# EAGLE design RGBLEDModule (EAGLE 5.10)
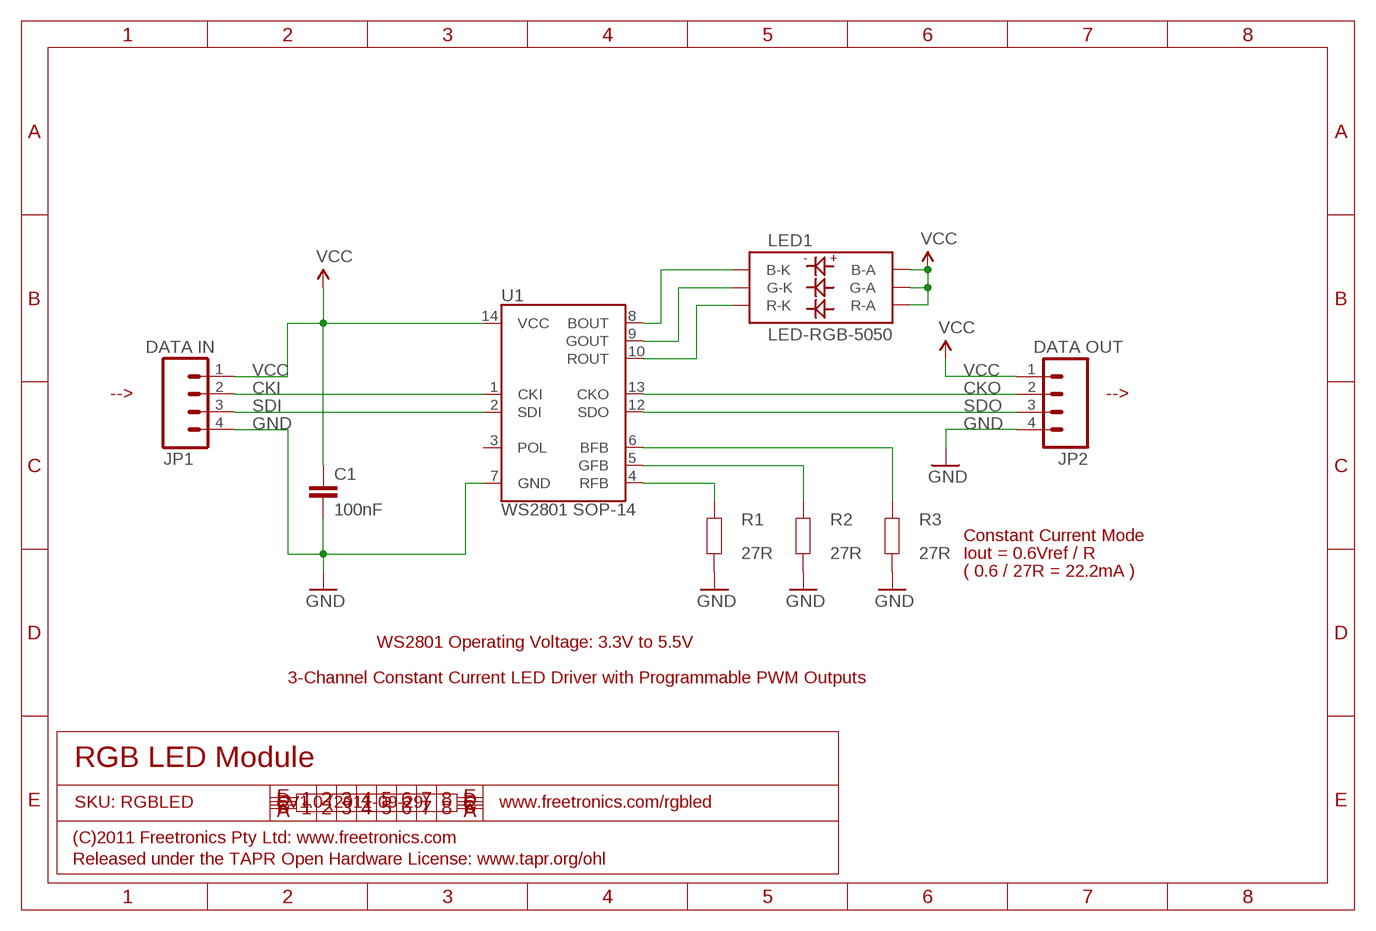
[diagram p0: schematic, sheet 1]

## Parts
C1  100nF  CAP0603  [0603]
JP1  DATA IN  M04PTH  [1X04]
JP2  DATA OUT  M04PTH  [1X04]
LED1  LED-RGB-5050  LED-RGB-50505050  [LED-RGB-5050]
R1  27R  RESISTOR0603  [0603]
R2  27R  RESISTOR0603  [0603]
R3  27R  RESISTOR0603  [0603]
U1  WS2801 SOP-14  WS2801  [SOP-14]

## Nets
CKI: JP1.2 U1.1(CKI)
CKO: JP2.2 U1.13(CKO)
GND: C1.2 JP1.4 JP2.4 R1.1 R2.1 R3.1 U1.7(GND)
N$7: LED1.BK(B-K) U1.8(BOUT)
N$8: LED1.GK(G-K) U1.9(GOUT)
N$9: LED1.RK(R-K) U1.10(ROUT)
N$13: R1.2 U1.4(RFB)
N$14: R2.2 U1.5(GFB)
N$15: R3.2 U1.6(BFB)
SDI: JP1.3 U1.2(SDI)
SDO: JP2.3 U1.12(SDO)
VCC: C1.1 JP1.1 JP2.1 LED1.BA(B-A) LED1.GA(G-A) LED1.RA(R-A) U1.14(VCC)
Unconnected: U1.3(POL)

## Notes on the sheet
- --> | -->
- Constant Current Mode
- Iout = 0.6Vref / R
- ( 0.6 / 27R = 22.2mA )
- WS2801 Operating Voltage: 3.3V to 5.5V
- 3-Channel Constant Current LED Driver with Programmable PWM Outputs
- RGB LED Module
- SKU: RGBLED | V1.0 (2011-09-29) | www.freetronics.com/rgbled
- (C)2011 Freetronics Pty Ltd: www.freetronics.com
- Released under the TAPR Open Hardware License: www.tapr.org/ohl

## Library data of the parts
C1 = freetronics-master-v1:CAP: Capacitor Standard 0603 ceramic capacitor, and 0.1" leaded capacitor.
JP1 JP2 = freetronics-master-v1:M04: Header 4 Standard 4-pin 0.1" header. Use with straight break away headers (SKU : PRT-00116), right angle break away headers (PRT-00553), swiss pins (PRT-00743), machine pins (PRT-00117), and female headers (PRT-00115). Molex polarized connector foot print use with SKU : PRT-08231 with associated crimp pins and housings.
LED1 = freetronics-master-v1:LED-RGB-5050
R1-R3 = freetronics-master-v1:RESISTOR: Resistor Basic schematic elements and footprints for 0603, 1206, and PTH 1/10th watt (small) resistors.
U1 = freetronics-master-v1:WS2801: WS2801 3 Channel Constant Current LED Driver with programmable PWM Outputs.

## Board
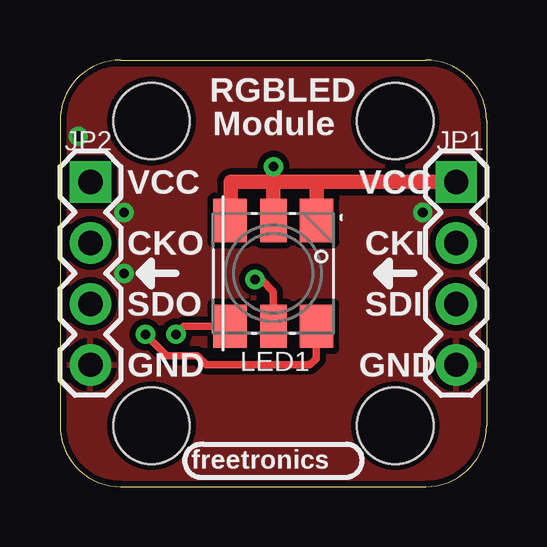
[diagram p1: board, top side]
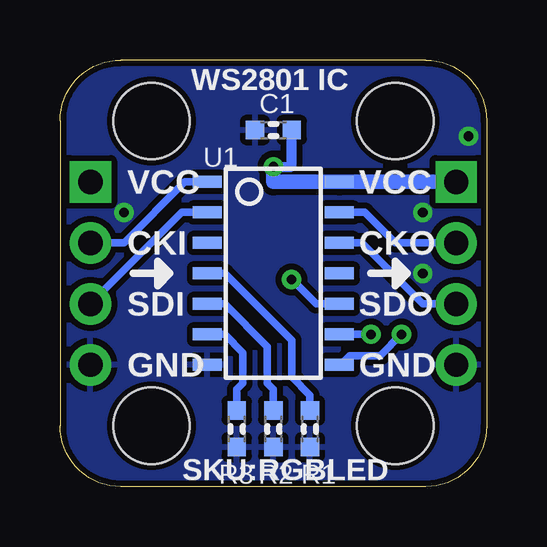
[diagram p2: board, bottom side, seen from below]

Size 17.78 x 17.78 mm. Coordinates in mm from the lower left corner, seen from the top.
Outline: 0,2.54 arc90 2.54,0 15.24,0 arc90 17.78,2.54 17.78,15.24 arc90 15.24,17.78 2.54,17.78 arc90 0,15.24 0,2.54
Copper layers (1*16): Top 0.035mm / dielectric 1.5mm / Bottom 0.035mm
Design rules "default *": minimum track width 8mil, minimum drill 15mil, track to track 10mil, track to pad 10mil, pad to pad 10mil, via to via 10mil, smd to smd 8mil, copper to edge 10mil, drill to drill 8mil, minimum pad ring 14mil, minimum via ring 8mil, stop-mask expansion 4mil, vias tented up to drill 25mil, thermal gap 10mil
Holes 3.17 mm at 3.81,2.54 13.97,2.54 3.81,15.24 13.97,15.24

### Footprints (pad centres in the part's own frame; a part is rotated, then mirrored left to right if it is on the bottom)
0603 = smd 0.762 x 0.762: 1 -0.762,0; 2 0.762,0
1X04 = drill 1.016 square: 1 0,0 | drill 1.016 round: 2 2.54,0; 3 5.08,0; 4 7.62,0
LED-RGB-5050 = smd 1.8 x 1.4: BA -2.2,1.8; BK 2.2,1.8; GA -2.2,-1.8; GK 2.2,-1.8 | smd 1.8 x 1.1: RA -2.2,0; RK 2.2,0
SOP-14 = smd 0.5 x 1.2: 1 -3.81,-2.75; 2 -2.54,-2.75; 3 -1.27,-2.75; 4 0,-2.75; 5 1.27,-2.75; 6 2.54,-2.75; 7 3.81,-2.75; 8 3.81,2.75; 9 2.54,2.75; 10 1.27,2.75; 11 0,2.75; 12 -1.27,2.75; 13 -2.54,2.75; 14 -3.81,2.75

### Placement (x,y rotation side)
C1  8.89,14.86 180 bottom
JP1  16.51,12.7 270 top
JP2  1.27,12.7 270 top
LED1  8.89,8.89 270 top
R1  7.37,2.41 90 bottom
R2  8.89,2.41 90 bottom
R3  10.41,2.41 90 bottom
U1  8.89,8.89 270 bottom

### Tracks (layer width: path | path; a pad name or v marks a point on that pad's centre or on a via)
CKI
  Bottom 0.305: JP1.2 15.11,10.16 12.57,12.7 U1.1
CKO
  Bottom 0.305: JP2.2 3.81,10.16 5.08,11.43 U1.13
GND  (via drill 0.4)
  other vias: 2.67,8.89 2.67,11.43 15.11,11.43 0.76,14.61
  pour Top: 0,15.24 arc-90 2.54,17.78 15.24,17.78 arc-90 17.78,15.24 17.78,2.54 arc-90 15.24,0 2.54,0 arc-90 0,2.54
  pour Bottom: 0,15.24 arc-90 2.54,17.78 15.24,17.78 arc-90 17.78,15.24 17.78,2.54 arc-90 15.24,0 2.54,0 arc-90 0,2.54
N$7  (via drill 0.4)
  Top 0.305: v3.56,6.35 4.45,5.46 5.71,5.46 6.1,5.08 10.41,5.08 10.67,5.33 10.67,6.67 LED1.BK
  Bottom 0.305: U1.8 6.1,5.08 5.71,5.46 4.45,5.46 v3.56,6.35
N$8  (via drill 0.4)
  Top 0.305: v4.83,6.35 5.17,6.69 LED1.GK
  Bottom 0.305: v4.83,6.35 U1.9
N$9  (via drill 0.4)
  Top 0.305: v8.13,8.64 8.38,8.64 8.89,8.13 LED1.RK
  Bottom 0.305: U1.10 7.11,7.62 v8.13,8.64
N$13
  Bottom 0.305: R1.2 7.37,3.81 8.13,4.57 8.13,6.1 10.92,8.89 U1.4
N$14
  Bottom 0.305: R2.2 8.89,4.06 9.14,4.32 9.14,5.84 10.92,7.62 U1.5
N$15
  Bottom 0.305: R3.2 10.41,4.06 10.16,4.32 10.16,5.59 10.92,6.35 U1.6
SDI
  Bottom 0.305: JP1.3 12.7,11.43 U1.2
SDO
  Bottom 0.305: JP2.3 2.67,7.62 5.21,10.16 U1.12
VCC  (via drill 0.4)
  Top 0.61: 8.89,12.7 7.11,12.7 7.11,11.11 LED1.GA | 8.89,12.7 10.67,12.7 | 10.67,12.7 JP1.1 | 8.89,12.7 LED1.RA | LED1.BA 10.69,12.68 10.67,12.7 | v8.89,13.34 8.89,12.7
  Bottom 0.406: v8.89,13.34 8.13,13.34 C1.1
  Bottom 0.61: JP2.1 U1.14 8.89,12.7 v8.89,13.34

### Text on the board
tPlace: RGBLED | Module | VCC | VCC | CKO | CKI | SDO | SDI | GND | GND | freetronics
bPlace: WS2801 IC | VCC | VCC | CKO | CKI | SDO | SDI | GND | GND | SKU:RGBLED